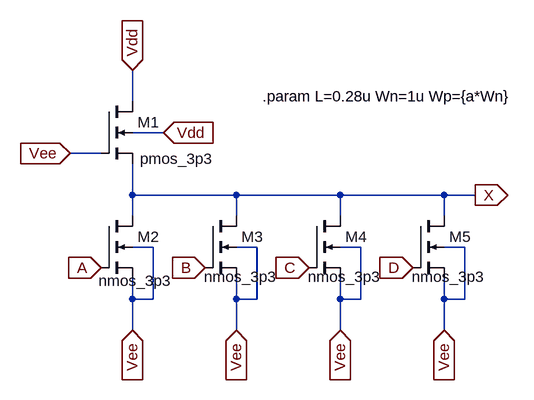
[diagram p0: schematic pseudoNOR-4.asc]
pseudoNOR-4.asc, the LTspice schematic file:
Version 4.1
SHEET 1 2956 680
WIRE 1680 -336 1680 -384
WIRE 1728 -288 1680 -288
WIRE 1632 -256 1584 -256
WIRE 1680 -192 1680 -240
WIRE 1840 -192 1680 -192
WIRE 2000 -192 1840 -192
WIRE 2160 -192 2000 -192
WIRE 2208 -192 2160 -192
WIRE 1680 -160 1680 -192
WIRE 1840 -160 1840 -192
WIRE 2000 -160 2000 -192
WIRE 2160 -160 2160 -192
WIRE 1712 -112 1680 -112
WIRE 1872 -112 1840 -112
WIRE 2032 -112 2000 -112
WIRE 2192 -112 2160 -112
WIRE 1680 -32 1680 -64
WIRE 1712 -32 1712 -112
WIRE 1712 -32 1680 -32
WIRE 1840 -32 1840 -64
WIRE 1872 -32 1872 -112
WIRE 1872 -32 1840 -32
WIRE 2000 -32 2000 -64
WIRE 2032 -32 2032 -112
WIRE 2032 -32 2000 -32
WIRE 2160 -32 2160 -64
WIRE 2192 -32 2192 -112
WIRE 2192 -32 2160 -32
WIRE 1680 16 1680 -32
WIRE 1840 16 1840 -32
WIRE 2000 16 2000 -32
WIRE 2160 16 2160 -32
FLAG 1680 -384 Vdd
IOPIN 1680 -384 In
FLAG 1632 -80 A
IOPIN 1632 -80 In
FLAG 1792 -80 B
IOPIN 1792 -80 In
FLAG 1840 16 Vee
IOPIN 1840 16 In
FLAG 1680 16 Vee
IOPIN 1680 16 In
FLAG 1728 -288 Vdd
IOPIN 1728 -288 In
FLAG 1584 -256 Vee
IOPIN 1584 -256 In
FLAG 1952 -80 C
IOPIN 1952 -80 In
FLAG 2000 16 Vee
IOPIN 2000 16 In
FLAG 2208 -192 X
IOPIN 2208 -192 Out
FLAG 2112 -80 D
IOPIN 2112 -80 In
FLAG 2160 16 Vee
IOPIN 2160 16 In
SYMBOL nmos4 1792 -160 R0
WINDOW 3 -2 94 Left 2
SYMATTR Value nmos_3p3
SYMATTR InstName M3
SYMATTR Value2 l={L} w={Wn}
SYMBOL nmos4 1632 -336 R0
WINDOW 3 60 88 Left 2
SYMATTR Value pmos_3p3
SYMATTR InstName M1
SYMATTR Value2 l={L} w={Wp}
SYMBOL nmos4 1632 -160 R0
WINDOW 3 -4 100 Left 2
SYMATTR Value nmos_3p3
SYMATTR InstName M2
SYMATTR Value2 l={L} w={Wn}
SYMBOL nmos4 1952 -160 R0
WINDOW 3 -2 94 Left 2
SYMATTR Value nmos_3p3
SYMATTR InstName M4
SYMATTR Value2 l={L} w={Wn}
SYMBOL nmos4 2112 -160 R0
WINDOW 3 -2 94 Left 2
SYMATTR Value nmos_3p3
SYMATTR InstName M5
SYMATTR Value2 l={L} w={Wn}
TEXT 1880 -344 Left 2 !.param L=0.28u Wn=1u Wp={a*Wn}

The netlist it stands for:
* pseudoNOR-4.asc
M3 X B Vee Vee nmos_3p3 l={L} w={Wn}
M1 Vdd Vee X Vdd pmos_3p3 l={L} w={Wp}
M2 X A Vee Vee nmos_3p3 l={L} w={Wn}
M4 X C Vee Vee nmos_3p3 l={L} w={Wn}
M5 X D Vee Vee nmos_3p3 l={L} w={Wn}
.model NMOS NMOS
.model PMOS PMOS
.lib standard.mos
.param L=0.28u Wn=1u Wp={a*Wn}
.backanno
.end